# EAGLE schematic Teensy Omnichord (EAGLE 7.2.0)
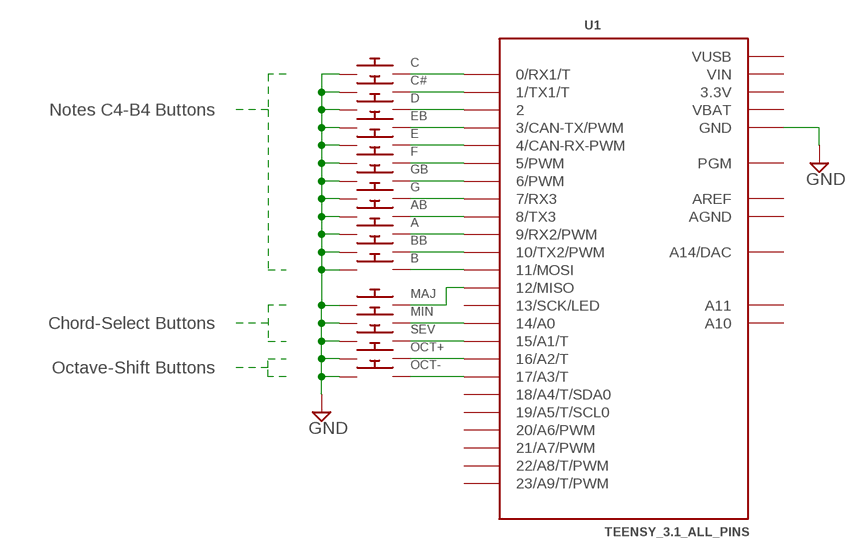
[diagram p0: schematic, sheet 1]

## Parts
A  SWITCH_PUSHBUTTONSOFTTOUCHSMD_SJ  [PUSHBUTTON_SMD_SJ]
AB  SWITCH_PUSHBUTTONSOFTTOUCHSMD_SJ  [PUSHBUTTON_SMD_SJ]
B  SWITCH_PUSHBUTTONSOFTTOUCHSMD_SJ  [PUSHBUTTON_SMD_SJ]
BB  SWITCH_PUSHBUTTONSOFTTOUCHSMD_SJ  [PUSHBUTTON_SMD_SJ]
C  SWITCH_PUSHBUTTONSOFTTOUCHSMD_SJ  [PUSHBUTTON_SMD_SJ]
C#  SWITCH_PUSHBUTTONSOFTTOUCHSMD_SJ  [PUSHBUTTON_SMD_SJ]
D  SWITCH_PUSHBUTTONSOFTTOUCHSMD_SJ  [PUSHBUTTON_SMD_SJ]
E  SWITCH_PUSHBUTTONSOFTTOUCHSMD_SJ  [PUSHBUTTON_SMD_SJ]
EB  SWITCH_PUSHBUTTONSOFTTOUCHSMD_SJ  [PUSHBUTTON_SMD_SJ]
F  SWITCH_PUSHBUTTONSOFTTOUCHSMD_SJ  [PUSHBUTTON_SMD_SJ]
G  SWITCH_PUSHBUTTONSOFTTOUCHSMD_SJ  [PUSHBUTTON_SMD_SJ]
GB  SWITCH_PUSHBUTTONSOFTTOUCHSMD_SJ  [PUSHBUTTON_SMD_SJ]
MAJ  SWITCH_PUSHBUTTONSOFTTOUCHSMD_SJ  [PUSHBUTTON_SMD_SJ]
MIN  SWITCH_PUSHBUTTONSOFTTOUCHSMD_SJ  [PUSHBUTTON_SMD_SJ]
OCT+  SWITCH_PUSHBUTTONSOFTTOUCHSMD_SJ  [PUSHBUTTON_SMD_SJ]
OCT-  SWITCH_PUSHBUTTONSOFTTOUCHSMD_SJ  [PUSHBUTTON_SMD_SJ]
SEV  SWITCH_PUSHBUTTONSOFTTOUCHSMD_SJ  [PUSHBUTTON_SMD_SJ]
U1  TEENSY_3.1_ALL_PINS  [TEENSY3-ALL_PINS]

## Nets
GND: A.P$1 AB.P$1 B.P$1 BB.P$1 C#.P$1 C.P$1 D.P$1 E.P$1 EB.P$1 F.P$1 G.P$1 GB.P$1 MAJ.P$1 MIN.P$1 OCT+.P$1 OCT-.P$1 SEV.P$1 U1.GND U1.GND1(GND)
N$1: C.P$2 U1.0(0/RX1/T)
N$2: C#.P$2 U1.1(1/TX1/T)
N$3: D.P$2 U1.2
N$4: EB.P$2 U1.3(3/CAN-TX/PWM)
N$5: E.P$2 U1.4(4/CAN-RX-PWM)
N$6: F.P$2 U1.5(5/PWM)
N$7: GB.P$2 U1.6(6/PWM)
N$8: G.P$2 U1.7(7/RX3)
N$9: AB.P$2 U1.8(8/TX3)
N$10: A.P$2 U1.9(9/RX2/PWM)
N$11: BB.P$2 U1.10(10/TX2/PWM)
N$12: B.P$2 U1.11(11/MOSI)
N$13: MAJ.P$2 U1.12(12/MISO)
N$15: MIN.P$2 U1.14/A0
N$16: SEV.P$2 U1.15/A1(15/A1/T)
N$17: OCT+.P$2 U1.16/A2(16/A2/T)
N$18: OCT-.P$2 U1.17/A3(17/A3/T)
Unconnected: U1.13(13/SCK/LED) U1.18/A4(18/A4/T/SDA0) U1.19/A5(19/A5/T/SCL0) U1.20/A6(20/A6/PWM) U1.21/A7(21/A7/PWM) U1.22/A8(22/A8/T/PWM) U1.23/A9(23/A9/T/PWM) U1.A10 U1.A11 U1.PGM U1.RESET/DAC(A14/DAC)

## Notes on the sheet
- Notes C4-B4 Buttons
- Chord-Select Buttons
- Octave-Shift Buttons

## Power pins joined to a net without a drawn wire
3.3V: U1.3.3V U1.3.3V1(3.3V)
AGND: U1.AGND
AREF: U1.AREF
VBAT: U1.VBAT
VIN: U1.VIN
VUSB: U1.VUSB

## Library data of the parts
A AB B BB C C# D E EB F G GB MAJ MIN OCT+ OCT- SEV = adafruit:SWITCH_PUSHBUTTON: Buttons SOFTTOUCHSMD_SJ - Soft touch temporary push button (Super Junk Akihabara) Compatible with SKPMANE010 [Mouser: 688-SKPMAN] C&K_KSS = Digikey: KSS221GLFS
U1 = Teensy_3_and_LC_Series_Boards_v1.1:TEENSY_3.1_ALL_PINS: Footprint for Teensy 3.1 or 3.2 board using all through-holes, i.e. the entire perimeter plus the 4 through-holes inboard (A10,A11,AREF, VUSB)